# Altium schematic sheet primary_LTC.SchDoc: foxBMS BMS-Slave 12-Cell
size A3; DocumentNumber: 2; SheetNumber: 2; SheetTotal: 19; AUTHOR: Fraunhofer IISB foxBMS Team; SheetDescription: Primary LTC6811
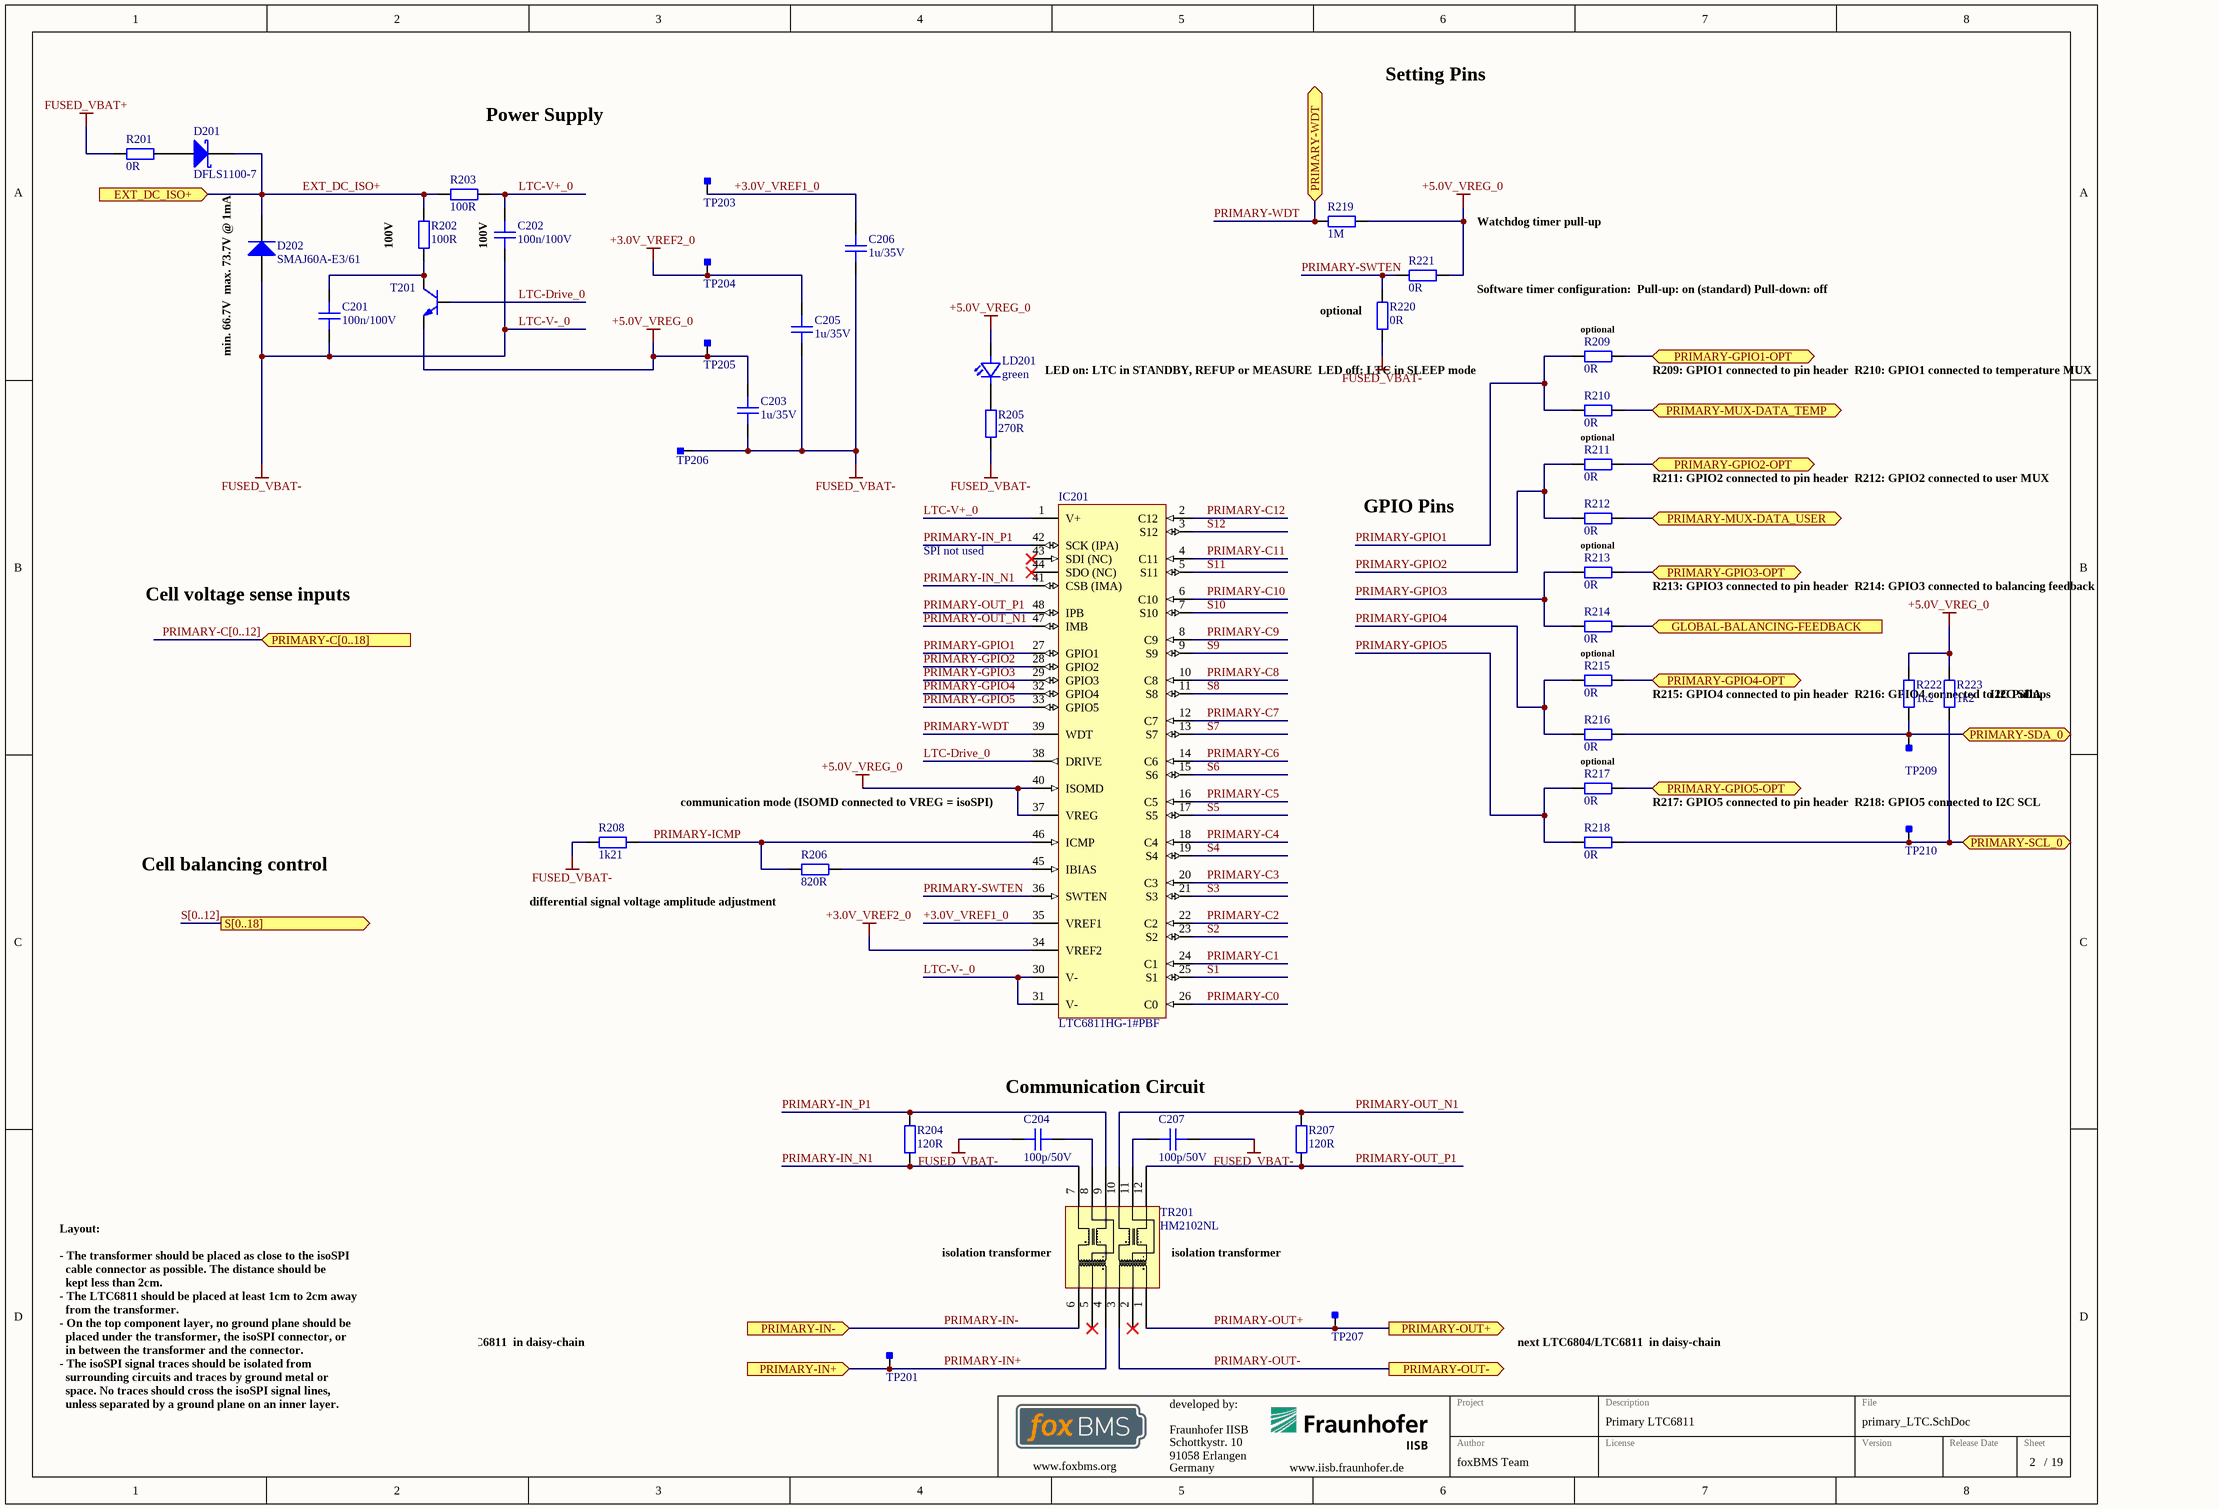
[diagram p0: primary_LTC.SchDoc]

## Parts
C201  100n/100V  [CAPC2012X14N]
C202  100n/100V  [CAPC2012X14N]
C203  1u/35V  [CAPC1608X08N]
C204  100p/50V  [CAPC1608X08N]
C205  1u/35V  [CAPC1608X08N]
C206  1u/35V  [CAPC1608X08N]
C207  100p/50V  [CAPC1608X08N]
D201  DFLS1100-7  [DIOD-POWERDI123-2_V]
D202  SMAJ60A-E3/61  [VISH-DO-214AC-2_N]
IC201  LTC6811HG-1#PBF  [LT-G-48_L]
LD201  green  [LEDC1608X07N]
R201  0R  [RESC2012X05N]
R202  100R  [RESC2012X05N]
R203  100R  [RESC2012X05N]
R204  120R  [RESC1608X05N]
R205  270R  [RESC1608X05N]
R206  820R  [RESC1608X05N]
R207  120R  [RESC1608X05N]
R208  1k21  [RESC1608X05N]
R209  0R  [RESC1608X05N]
R210  0R  [RESC1608X05N]
R211  0R  [RESC1608X05N]
R212  0R  [RESC1608X05N]
R213  0R  [RESC1608X05N]
R214  0R  [RESC1608X05N]
R215  0R  [RESC1608X05N]
R216  0R  [RESC1608X05N]
R217  0R  [RESC1608X05N]
R218  0R  [RESC1608X05N]
R219  1M  [RESC1608X05N]
R220  0R  [RESC1608X05N]
R221  0R  [RESC1608X05N]
R222  1k2  [RESC1608X05N]
R223  1k2  [RESC1608X05N]
T201  PBHV8115Z  [SOT230P700X180-4N]  (value not drawn)
TP201  Testpoint_Square  [Testpoint_S1]  (value not drawn)  (no BOM)
TP203  Testpoint_Square  [Testpoint_S1]  (value not drawn)  (no BOM)
TP204  Testpoint_Square  [Testpoint_S1]  (value not drawn)  (no BOM)
TP205  Testpoint_Square  [Testpoint_S1]  (value not drawn)  (no BOM)
TP206  Testpoint_Square  [Testpoint_S1]  (value not drawn)  (no BOM)
TP207  Testpoint_Square  [Testpoint_S1]  (value not drawn)  (no BOM)
TP209  Testpoint_Square  [Testpoint_S1]  (value not drawn)  (no BOM)
TP210  Testpoint_Square  [Testpoint_S1]  (value not drawn)  (no BOM)
TR201  HM2102NL  [HM2102NL]

## Ports
EXT_DC_ISO+ (in), GLOBAL-BALANCING-FEEDBACK (in), PRIMARY-C[0..18] (in), PRIMARY-GPIO1-OPT (bidir), PRIMARY-GPIO2-OPT (bidir), PRIMARY-GPIO3-OPT (bidir), PRIMARY-GPIO4-OPT (bidir), PRIMARY-GPIO5-OPT (bidir), PRIMARY-IN+ (in), PRIMARY-IN- (in), PRIMARY-MUX-DATA_TEMP (bidir), PRIMARY-MUX-DATA_USER (bidir), PRIMARY-OUT+ (out), PRIMARY-OUT- (out), PRIMARY-SCL_0 (bidir), PRIMARY-SDA_0 (bidir), PRIMARY-WDT (bidir), S[0..18] (out)

## Nets
+3.0V_VREF2_0: C205.2 IC201.34(VREF2) TP204.1
+5.0V_VREG_0: C203.2 IC201.37(VREG) IC201.40(ISOMD) LD201.2(A) R219.2 R221.2 R222.2 R223.2 T201.3(E) TP205.1
FUSED_VBAT+: R201.1
LTC-V-_0: C201.2 C202.2 C203.1 C204.1 C205.1 C206.1 C207.1 D202.2(A) IC201.30(V-) IC201.31(V-) R205.1 R208.1 R220.1 TP206.1  [also labelled FUSED_VBAT-]
+3.0V_VREF1_0: C206.2 IC201.35(VREF1) TP203.1
EXT_DC_ISO+: D201.2(K) D202.1(K) R202.2 R203.1 ; port EXT_DC_ISO+
GLOBAL-BALANCING-FEEDBACK: R214.1 ; port GLOBAL-BALANCING-FEEDBACK
LTC-Drive_0: IC201.38(DRIVE) T201.1(B)
LTC-V+_0: C202.1 IC201.1(V+) R203.2
PRIMARY-C0: IC201.26(C0)
PRIMARY-C1: IC201.24(C1)
PRIMARY-C2: IC201.22(C2)
PRIMARY-C3: IC201.20(C3)
PRIMARY-C4: IC201.18(C4)
PRIMARY-C5: IC201.16(C5)
PRIMARY-C6: IC201.14(C6)
PRIMARY-C7: IC201.12(C7)
PRIMARY-C8: IC201.10(C8)
PRIMARY-C9: IC201.8(C9)
PRIMARY-C10: IC201.6(C10)
PRIMARY-C11: IC201.4(C11)
PRIMARY-C12: IC201.2(C12)
PRIMARY-GPIO1: IC201.27(GPIO1) R209.2 R210.2
PRIMARY-GPIO1-OPT: R209.1 ; port PRIMARY-GPIO1-OPT
PRIMARY-GPIO2: IC201.28(GPIO2) R211.2 R212.2
PRIMARY-GPIO2-OPT: R211.1 ; port PRIMARY-GPIO2-OPT
PRIMARY-GPIO3: IC201.29(GPIO3) R213.2 R214.2
PRIMARY-GPIO3-OPT: R213.1 ; port PRIMARY-GPIO3-OPT
PRIMARY-GPIO4: IC201.32(GPIO4) R215.2 R216.2
PRIMARY-GPIO4-OPT: R215.1 ; port PRIMARY-GPIO4-OPT
PRIMARY-GPIO5: IC201.33(GPIO5) R217.2 R218.2
PRIMARY-GPIO5-OPT: R217.1 ; port PRIMARY-GPIO5-OPT
PRIMARY-ICMP: IC201.46(ICMP) R206.1 R208.2
PRIMARY-IN+: TP201.1 TR201.4 ; port PRIMARY-IN+
PRIMARY-IN-: TR201.6 ; port PRIMARY-IN-
PRIMARY-IN_N1: IC201.41(CSB_(IMA)) R204.2 TR201.7
PRIMARY-IN_P1: IC201.42(SCK_(IPA)) R204.1 TR201.9
PRIMARY-MUX-DATA_TEMP: R210.1 ; port PRIMARY-MUX-DATA_TEMP
PRIMARY-MUX-DATA_USER: R212.1 ; port PRIMARY-MUX-DATA_USER
PRIMARY-OUT+: TP207.1 TR201.1 ; port PRIMARY-OUT+
PRIMARY-OUT-: TR201.3 ; port PRIMARY-OUT-
PRIMARY-OUT_N1: IC201.47(IMB) R207.2 TR201.10
PRIMARY-OUT_P1: IC201.48(IPB) R207.1 TR201.12
PRIMARY-SCL_0: R218.1 R223.1 TP210.1 ; port PRIMARY-SCL_0
PRIMARY-SDA_0: R216.1 R222.1 TP209.1 ; port PRIMARY-SDA_0
PRIMARY-SWTEN: IC201.36(SWTEN) R220.2 R221.1
PRIMARY-WDT: IC201.39(WDT) R219.1 ; port PRIMARY-WDT
S1: IC201.25(S1)
S2: IC201.23(S2)
S3: IC201.21(S3)
S4: IC201.19(S4)
S5: IC201.17(S5)
S6: IC201.15(S6)
S7: IC201.13(S7)
S8: IC201.11(S8)
S9: IC201.9(S9)
S10: IC201.7(S10)
S11: IC201.5(S11)
S12: IC201.3(S12)
NetC201_1: C201.1 R202.1 T201.2(C) T201.4(C)
NetC204_2: C204.2 TR201.8
NetC207_2: C207.2 TR201.11
NetD201_1: D201.1(A) R201.2
NetIC201_45: IC201.45(IBIAS) R206.2
NetLD201_1: LD201.1(C) R205.2

Not connected (* = marked no-connect by the designer): IC201 43(SDI_(NC))* 44(SDO_(NC))*; TR201 2* 5*

## Buses and harness runs
bus PRIMARY-C[0..12] = port PRIMARY-C[0..18]
bus S[0..12] = port S[0..18]

## Notes on the sheet
- Setting Pins
- Power Supply
- (near R202) 100V
- (near C202) 100V
- Watchdog timer pull-up
- min. 66.7V
  max. 73.7V @ 1mA
- (near R220) optional
- Software timer configuration:
  Pull-up: on (standard)
  Pull-down: off
- LED on: LTC in STANDBY, REFUP or MEASURE
  LED off: LTC in SLEEP mode
- (near R209) optional
- R209: GPIO1 connected to pin header
  R210: GPIO1 connected to temperature MUX
- optional
- GPIO Pins
- R211: GPIO2 connected to pin header
  R212: GPIO2 connected to user MUX
- SPI not used
- R213: GPIO3 connected to pin header
  R214: GPIO3 connected to balancing feedback
- Cell voltage sense inputs
- R215: GPIO4 connected to pin header
  R216: GPIO4 connected to I2C SDA
- (near R223) I2C Pullups
- communication mode (ISOMD connected to VREG = isoSPI)
- (near TP210) R217: GPIO5 connected to pin header
  R218: GPIO5 connected to I2C SCL
- Cell balancing control
- (near R206) differential signal voltage amplitude adjustment
- Communication Circuit
- (near TR201) isolation transformer
- previous LTC6804/LTC6811
  in daisy-chain
- next LTC6804/LTC6811
  in daisy-chain
- Layout:
  - The transformer should be placed as close to the isoSPI
  cable connector as possible. The distance should be
  kept less than 2cm.
  - The LTC6811 should be placed at least 1cm to 2cm away
  from the transformer.
  - On the top component layer, no ground plane should be
  placed under the transformer, the isoSPI connector, or
  in between the transformer and the connector.
  - The isoSPI signal traces should be isolated from
  surrounding circuits and traces by ground metal or
  space. No traces should cross the isoSPI signal lines,
  unless separated by a ground plane on an inner layer.
- Fraunhofer IISB
- Schottkystr. 10
- developed by:
- 91058 Erlangen
- Germany
- Author
- Project
- License
- Description
- File
- Version
- Release Date
- Sheet
- www.foxbms.org
- www.iisb.fraunhofer.de
- foxBMS Team
- /

## Library data of the parts
C201 C202 = gen_C_ceramic_100n_100V_X7R_0805: MLCC; Capacitance: 100n; Rated Voltage: 100V; Dielectric: X7R; Case EIA: 0805; Case Metric: 2012; Automotive Qualified: False; Part Number: gen_C_ceramic_100n_100V_X7R_0805; Supplier 1: Farnell; Supplier Part Number 1: 2320821
C203 C205 C206 = gen_C_ceramic_1u_35V_X7R_0603: MLCC; Capacitance: 1u; Rated Voltage: 35V; Dielectric: X7R; Case EIA: 0603; Case Metric: 1608; PnP Package: C_0603_10; PnP Value: 1uF/35V/X7R; PnP equipped: x; Automotive Qualified: False; Part Number: gen_C_ceramic_1u_35V_X7R_0603; Supplier 1: Farnell; Supplier Part Number 1: 1907508
C204 C207 = gen_C_ceramic_100p_50V_C0G_0603: MLCC; Capacitance: 100p; Rated Voltage: 50V; Dielectric: C0G; Case EIA: 0603; Case Metric: 1608; Automotive Qualified: False; Part Number: gen_C_ceramic_100p_50V_C0G_0603; Supplier 1: Farnell; Supplier Part Number 1: 1414603
D201 = CMP-2000-05099-1: 1 A High Voltage Schottky Barrier Rectifier, 0.62 V, -55 to 175 degC, 2- Pin POWERDI123, Pb-Free, Tape and Reel; Manufacturer: Diodes Inc; Average Rectified Current-Max: 1A; Peak Current-Max: 40A; Forward Voltage: 0.77V; Reverse Current-Max: 1µA; Reverse Voltage-Max [Vrrm]: 100V; Datasheet Version: Sep-14; Datasheet URL: https://datasheet.ciiva.com/15144/getdatasheetpartid-44146-15144126.pdf; Manufacturer URL: http://www.diodes.com/
D202 = CMP-0548-00258-2: Transient Voltage Suppressor, 6.40 to 231 V, 60 V Stand-off Voltage, Uni-Directional, -55 to 155 degC, 2-pin DO-214AC, Pb-Free, Tape and Reel; Manufacturer: Vishay Semiconductor; VWM (V): 60; PPPM (W): 400, 300; VBR Uni-Directional (V): 6.4 to 231; IFSM: 40 A; ID (uA): 1; RoHS: TRUE; ComponentLink3Description: Package Specification; PackageReference: DO-214AC-2; PartNumber: SMAJ60A-E3/61; ComponentLink2Description: Datasheet; ComponentLink2URL: http://www.vishay.com/docs/88390/smaj50a.pdf; ComponentLink3URL: http://www.vishay.com/docs/88390/smaj50a.pdf; Packing: Tape and Reel; ComponentLink1Description: Manufacturer URL; PackageDescription: 2-Pin DO-214AC (SMA), Body 4.245 x 2.665 mm; DatasheetVersion: 12/8/2013; ComponentLink1URL: http://www.vishay.com/; Operating Junction and Storage Temperature Range: -55 to 150 degC; Mounting Technology: Surface Mount
IC201 = LTC6811HG-1#PBF: Multicell Battery Monitor, 60 V Vin MAX, 48-pin SOP (G-48), -40 to 125 degC, Pb-Free; Manufacturer: Linear Technology; Type of Charger: Battery Stack Monitor; Vin Max(V): 60; Battery Chemistry: Li-Ion, Li-Polymer, NiMH; Number of Cells: > 1000 V of stacked Li-Ion cells; Automotive Qualified: False; RoHS: TRUE; ComponentLink1Description: Datasheet; ComponentLink1URL: https://cds.linear.com/docs/en/datasheet/68111fb.pdf; PartNumber: LTC6811HG-1#PBF; PackageReference: G-48; PackageVersion: Rev. Ã˜, 01/2011; ComponentLink2Description: Datasheet; Mounting Technology: Surface Mount; ComponentLink3Description: Package Specification; PackageDescription: 48-Pin Plastic SSOP, Body 12.8 x 5.3 mm, Pitch 0.5 mm; ComponentLink3URL: http://cds.linear.com/docs/en/packaging/05081887_0_G48.pdf; ComponentLink2URL: http://cds.linear.com/docs/en/datasheet/680412f.pdf; Part Number: LTC6811HG-1#PBF; Part Name: LTC6811HG-1#PBF; Operating Temperature: -40°C - +125°C; Supplier 1: Digikey; Supplier Part Number 1: LTC6811HG-1#PBF-ND
LD201 = gen_LED_0603_green: LED; Breakdown Voltage: 5V; Continuous Forward Current: 20mA; Forward Voltage @ 20mA: 2.2V; Automotive Qualified: False; Part Number: gen_LED_0603_green; Color: green; Supplier 1: Farnell; Supplier Part Number 1: 2099223; PnP Package: LED_0603
R201 = gen_R_0R_0805: SMD Resistor 0R 0805; Power: 0.125W; Case EIA: 0805; Case Metric: 2012; Maximum Working Voltage: 150V; PnP Package: R_0805; Automotive Qualified: False; Part Number: gen_R_0R_0805; Operating Temperature: -55°C - +155°C; Resistance: 0R; Series: Jumper; PnP Value: 0R; Supplier 1: Farnell; Supplier Part Number 1: 2057661
R202 R203 = gen_R_100R_0805: SMD Resistor 100R 0805; Tolerance: 1%; Power: 0.125W; Case EIA: 0805; Case Metric: 2012; Maximum Working Voltage: 150V; PnP Package: R_0805; Automotive Qualified: False; Part Number: gen_R_100R_0805; Operating Temperature: -55°C - +155°C; Resistance: 100R; Series: E24, E96; PnP Value: 100R; Supplier 1: Farnell; Supplier Part Number 1: 1469862
R204 R207 = gen_R_120R_0603: SMD Resistor 120R 0603; Tolerance: 1%; Power: 0.1W; Case EIA: 0603; Case Metric: 1608; Maximum Working Voltage: 75V; PnP Package: R_0603; Automotive Qualified: False; Part Number: gen_R_120R_0603; Operating Temperature: -55°C - +155°C; Resistance: 120R; Series: E24; PnP Value: 120R; Supplier 1: Farnell; Supplier Part Number 1: 2073369
R205 = gen_R_270R_0603: SMD Resistor 270R 0603; Tolerance: 1%; Power: 0.1W; Case EIA: 0603; Case Metric: 1608; Maximum Working Voltage: 75V; PnP Package: R_0603; Automotive Qualified: False; Part Number: gen_R_270R_0603; Operating Temperature: -55°C - +155°C; Resistance: 270R; Series: E24; PnP Value: 270R; Supplier 1: Farnell; Supplier Part Number 1: 2141320
R206 = gen_R_820R_0603: SMD Resistor 820R 0603; Tolerance: 1%; Power: 0.1W; Case EIA: 0603; Case Metric: 1608; Maximum Working Voltage: 75V; PnP Package: R_0603; Automotive Qualified: False; Part Number: gen_R_820R_0603; Operating Temperature: -55°C - +155°C; Resistance: 820R; Series: E24; PnP Value: 820R; Supplier 1: Farnell; Supplier Part Number 1: 1469841
R208 = gen_R_1k21_0603: SMD Resistor 1k21 0603; Tolerance: 1%; Power: 0.1W; Case EIA: 0603; Case Metric: 1608; Maximum Working Voltage: 75V; PnP Package: R_0603; Automotive Qualified: False; Part Number: gen_R_1k21_0603; Operating Temperature: -55°C - +155°C; Resistance: 1k21; Series: E96; PnP Value: 1k21; Supplier 1: Farnell; Supplier Part Number 1: 1652852
R209-R218 R220 R221 = gen_R_0R_0603: SMD Resistor 0R 0603; Power: 0.1W; Case EIA: 0603; Case Metric: 1608; Maximum Working Voltage: 75V; PnP Package: R_0603; Automotive Qualified: False; Part Number: gen_R_0R_0603; Operating Temperature: -55°C - +155°C; Resistance: 0R; Series: Jumper; PnP Value: 0R; Supplier 1: Farnell; Supplier Part Number 1: 2073345
R219 = gen_R_1M_0603: SMD Resistor 1M 0603; Tolerance: 1%; Power: 0.1W; Case EIA: 0603; Case Metric: 1608; Maximum Working Voltage: 75V; PnP Package: R_0603; Automotive Qualified: False; Part Number: gen_R_1M_0603; Operating Temperature: -55°C - +155°C; Resistance: 1M; Series: E24, E96; PnP Value: 1M; Supplier 1: Farnell; Supplier Part Number 1: 1469746
R222 R223 = gen_R_1k2_0603: SMD Resistor 1k2 0603; Tolerance: 1%; Power: 0.1W; Case EIA: 0603; Case Metric: 1608; Maximum Working Voltage: 75V; PnP Package: R_0603; Automotive Qualified: False; Part Number: gen_R_1k2_0603; Operating Temperature: -55°C - +155°C; Resistance: 1k2; Series: E24; PnP Value: 1k2; Supplier 1: Farnell; Supplier Part Number 1: 2073370
T201 = PBHV8115Z: 150 V, 1 A NPN high-voltage low V / CEsat / (BISS) transistor; Manufacturer: Nexperia; Maximum Drain-Source Voltage: 150V; Maximum Continous Drain Current (25°C): 1A; Automotive Qualified: True; Part Number: PBHV8115Z; Part Name: NPN; Operating Temperature: -55°C - +150°C; ComponentLink1Description: Datasheet; ComponentLink1URL: http://www.farnell.com/datasheets/609423.pdf; Supplier 1: Farnell; Supplier Part Number 1: 1829309
TP201 TP203-TP207 TP209 TP210 = Testpoint_Square: Testpoint, square; Part Number: Testpoint_Square
TR201 = HM2102NL: Pulse HM2102NL BMS Transformer; Automotive Qualified: True; Part Number: HM2102NL; Manufacturer: Pulse; Operating Temperature: -40°C - +125°C; ComponentLink1Description: Datasheet; ComponentLink1URL: https://www.mouser.com/ds/2/336/HM2102NL-1218600.pdf; Supplier 1: Mouser; Supplier Part Number 1: 673-HM2102NL; Supplier 2: Digikey; Supplier Part Number 2: 1840-1034-1-ND